# EAGLE schematic test_path_thickness (EAGLE 7.6.0)
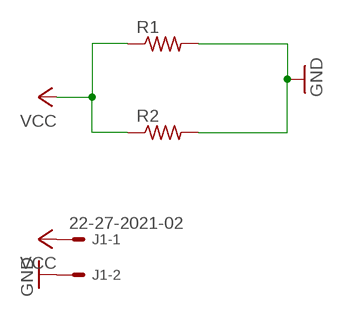
[diagram p0: schematic, sheet 1]

## Parts
J1  22-27-2021-02  [6410-02]
R1  R-US_0207/7  [0207/7]
R2  R-US_0207/7  [0207/7]

## Nets
GND: J1.2 R1.2 R2.2
R1VCC: R1.1
R2VCC: R2.1
VCC: J1.1

## Library data of the parts
J1 = con-molex:22-?-02: CONNECTOR wire to board 2.54 mm (.1 inch) pitch header; OC_FARNELL: unknown; OC_NEWARK: unknown
R1 R2 = rcl:R-US_: RESISTOR, American symbol